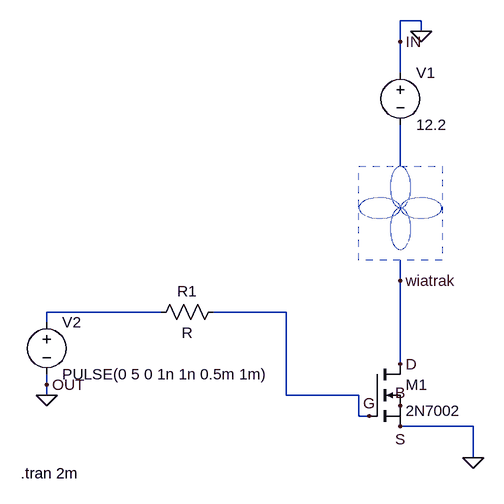
[diagram p0: schematic wentylator.asc]
wentylator.asc, the LTspice schematic file:
Version 4.1
SHEET 1 880 680
WIRE 384 -416 352 -416
WIRE 384 -400 384 -416
WIRE 352 -384 352 -416
WIRE 352 -336 352 -384
WIRE 352 -192 352 -256
WIRE 352 -16 352 -48
WIRE -16 32 -192 32
WIRE 176 32 64 32
WIRE -192 48 -192 32
WIRE 352 112 352 -16
WIRE -192 144 -192 128
WIRE -192 160 -192 144
WIRE 176 160 176 32
WIRE 288 160 176 160
WIRE 288 192 288 160
WIRE 304 192 288 192
WIRE 464 208 352 208
WIRE 464 256 464 208
FLAG 384 -400 0
FLAG 464 256 0
FLAG -192 160 0
FLAG 352 -384 IN
FLAG -192 144 OUT
FLAG 352 112 D
FLAG 352 208 S
FLAG 304 192 G
FLAG 352 176 B
FLAG 352 -16 wiatrak
SYMBOL voltage 352 -352 R0
WINDOW 123 0 0 Left 0
WINDOW 39 0 0 Left 0
SYMATTR InstName V1
SYMATTR Value 12.2
SYMBOL res 80 16 R90
WINDOW 0 0 56 VBottom 2
WINDOW 3 32 56 VTop 2
SYMATTR InstName R1
SYMBOL voltage -192 32 R0
WINDOW 123 0 0 Left 0
WINDOW 39 0 0 Left 0
SYMATTR InstName V2
SYMATTR Value PULSE(0 5 0 1n 1n 0.5m 1m)
SYMBOL nmos 304 112 R0
SYMATTR InstName M1
SYMATTR Value 2N7002
TEXT -232 280 Left 2 !.tran 2m
RECTANGLE Normal 416 -48 288 -192 2
ARC Normal 288 -112 352 -144 284 -104 285 -110 2
ARC Normal 352 -112 416 -144 348 -104 349 -110 2
ARC Normal 368 -64 336 -128 376 -60 370 -61 2
ARC Normal 368 -128 336 -192 376 -124 370 -125 2

The netlist it stands for:
* wentylator.asc
V1 0 N001 12.2
R1 G N002 R
V2 N002 0 PULSE(0 5 0 1n 1n 0.5m 1m)
M1 wiatrak G 0 0 2N7002
.model NMOS NMOS
.model PMOS PMOS
.lib standard.mos
.tran 2m
.backanno
.end